# EAGLE design DCCInterfaceShield (EAGLE 9.6.2)
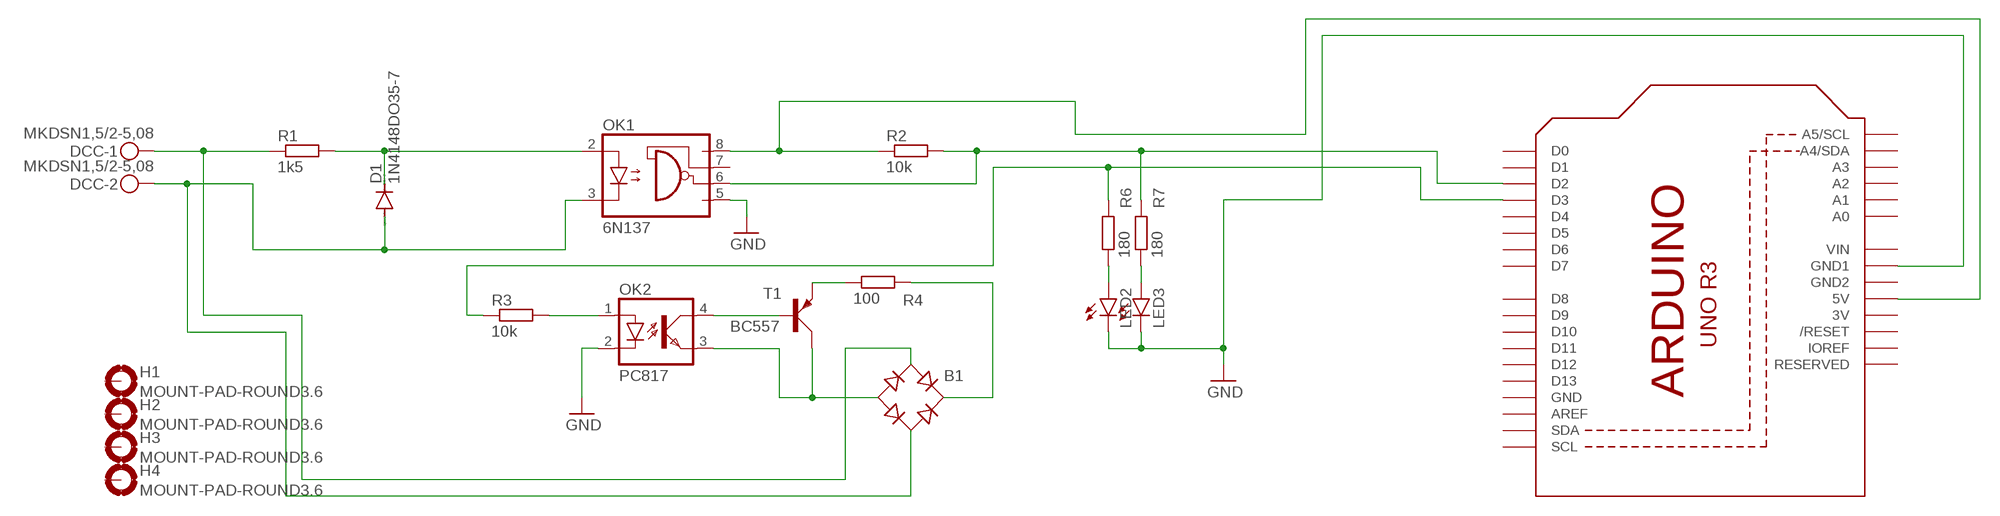
[diagram p0: schematic, sheet 1]

## Parts
B1  RB1A  [RB1A]
D1  1N4148DO35-7  [DO35-7]
DCC  MKDSN1,5/2-5,08  [MKDSN1,5/2-5,08]
H1  MOUNT-PAD-ROUND3.6  [3,6-PAD]
H2  MOUNT-PAD-ROUND3.6  [3,6-PAD]
H3  MOUNT-PAD-ROUND3.6  [3,6-PAD]
H4  MOUNT-PAD-ROUND3.6  [3,6-PAD]
LED2  LED3MM  [LED3MM]
LED3  LED3MM  [LED3MM]
OK1  6N137  [DIL08]
OK2  PC817  [DIL04]
R1  1k5  R-EU_0204/7  [0204/7]
R2  10k  R-EU_0204/7  [0204/7]
R3  10k  R-EU_0204/7  [0204/7]
R4  100  R-EU_0204/7  [0204/7]
R6  180  R-EU_0204/7  [0204/7]
R7  180  R-EU_0204/7  [0204/7]
T1  BC557  [SOT54A]
U1  ARDUINOR3-BPLACE  [ARDUINOR3-BPLACE]

## Nets
GND [GND]: LED2.K(C) LED3.K(C) OK1.5(GND) OK2.2(C) U1.GND1
N$3: D1.C OK1.2(A) R1.2
N$4: LED2.A R6.1
N$5: OK1.6(VO) R2.2 R7.2 U1.D2
N$6 [DCC]: B1.AC1 DCC.1 R1.1
N$7: OK2.1(A) R3.2
N$8: OK2.4(COL) T1.B
N$9 [VCC]: B1.+ R4.2
N$10 [VCC]: B1.- OK2.3(EMIT) T1.C
N$11: R4.1 T1.E
N$12: R3.1 R6.2 U1.D3
N$13 [DCC]: B1.AC2 D1.A DCC.2 OK1.3(C)
N$14: LED3.A R7.1
N$15: OK1.8(VCC) R2.1 U1.5V
Unconnected: H1.B3,6(MOUNT) H2.B3,6(MOUNT) H3.B3,6(MOUNT) H4.B3,6(MOUNT) OK1.7(VE) U1.A0 U1.A1 U1.A2 U1.A3 U1.A4(A4/SDA) U1.A5(A5/SCL) U1.AREF U1.D0 U1.D1 U1.D4 U1.D5 U1.D6 U1.D7 U1.D8 U1.D9 U1.D10 U1.D11 U1.D12 U1.D13 U1.IOREF U1.RESERVED U1.RESET(/RESET) U1.SCL U1.SDA

## Power pins joined to a net without a drawn wire
3V: U1.3V
GND: U1.GND
GND2: U1.GND2
VIN: U1.VIN

## Library data of the parts
B1 = rectifier:RB1A: RECTIFIER 1 A
D1 = diode:1N4148: DIODE high speed (Philips)
DCC = con-phoenix-508:MKDSN1,5/2-5,08: MKDSN 1,5/ 2-5,08 Printklemme Nennstrom: 13,5 A Nennspannung: 250 V Rastermaß: 5,08 mm Polzahl: 2 Anschlussart: Schraubanschluss Montage: Löten Anschlussrichtung Leiter/Platine: 0 ° Artikelnummer: 1729128 Source: http://eshop.phoenixcontact.com .. 1729128.pdf
H1-H4 = holes:MOUNT-PAD-ROUND: MOUNTING PAD, round
LED2 LED3 = led:LED: LED OSRAM: - CHIPLED LG R971, LG N971, LY N971, LG Q971, LY Q971, LO R971, LY R971 LH N974, LH R974 LS Q976, LO Q976, LY Q976 LO Q996 - Hyper CHIPLED LW Q18S LB Q993, LB Q99A, LB R99A - SideLED LS A670, LO A670, LY A670, LG A670, LP A670 LB A673, LV A673, LT A673, LW A673 LH A674 LY A675 LS A676, LA A676, LO A676, LY A676, LW A676 LS A679, LY A679, LG A679 - Hyper Micro SIDELED® LS Y876, LA Y876, LO Y876, LY Y876 LT Y87S - SmartLED LW L88C, LW L88S LB L89C, LB L89S, LG L890 LS L89K, LO L89K, LY L89K LS L896, LA L896, LO L896, LY L896 - TOPLED LS T670, LO T670, LY T670, LG T670, LP T670 LSG T670, LSP T670, LSY T670, LOP T670, LYG T670 LG T671, LOG T671, LSG T671 LB T673, LV T673, LT T673, LW T673 LH T674 LS T676, LA T676, LO T676, LY T676, LB T676, LH T676, LSB T676, LW T676 LB T67C, LV T67C, LT T67C, LS T67K, LO T67K, LY T67K, LW E67C LS E67B, LA E67B, LO E67B, LY E67B, LB E67C, LV E67C, LT E67C LW T67C LS T679, LY T679, LG T679 LS T770, LO T770, LY T770, LG T770, LP T770 LB T773, LV T773, LT T773, LW T773 LH T774 LS E675, LA E675, LY E675, LS T675 LS T776, LA T776, LO T776, LY T776, LB T776 LHGB T686 LT T68C, LB T68C - Hyper Mini TOPLED® LB M676 - Mini TOPLED Santana® LG M470 LS M47K, LO M47K, LY M47K Source: http://www.osram.convergy.de LUXEON: - LUMILED® LXK2-PW12-R00, LXK2-PW12-S00, LXK2-PW14-U00, LXK2-PW14-V00 LXK2-PM12-R00, LXK2-PM12-S00, LXK2-PM14-U00 LXK2-PE12-Q00, LXK2-PE12-R00, LXK2-PE12-S00, LXK2-PE14-T00, LXK2-PE14-U00 LXK2-PB12-K00, LXK2-PB12-L00, LXK2-PB12-M00, LXK2-PB14-N00, LXK2-PB14-P00, LXK2-PB14-Q00 LXK2-PR12-L00, LXK2-PR12-M00, LXK2-PR14-Q00, LXK2-PR14-R00 LXK2-PD12-Q00, LXK2-PD12-R00, LXK2-PD12-S00 LXK2-PH12-R00, LXK2-PH12-S00 LXK2-PL12-P00, LXK2-PL12-Q00, LXK2-PL12-R00 Source: www.luxeon.com KINGBRIGHT: KA-3528ASYC Source: www.kingbright.com
OK1 = optocoupler:6N137: MOTOROLA OPTO COUPLER; MPN: 6N137; OC_FARNELL: 1328376; OC_NEWARK: 52M1895
OK2 = optocoupler:PC817: SHARP OPTO COUPLER; MPN: PC817X4J000F; OC_FARNELL: 9707727; OC_NEWARK: 97K7059
R1-R4 R6 R7 = rcl:R-EU_: RESISTOR, European symbol; SPICEPREFIX: R
T1 = transistor-small-signal:BC557: PNP TRANSISTOR
U1 = adafruit:ARDUINOR3: This is a new object for the new Arduino R3 - with extra pins that you may want to use (such as IOref, and duplicated A4/A5

## Net classes
0 default: width 0.381 mm, clearance 0.381 mm
1 GND: width 0.762 mm, clearance 0.381 mm
2 DCC: width 0.635 mm, clearance 0.381 mm
3 VCC: width 0.635 mm, clearance 0.381 mm

## Board
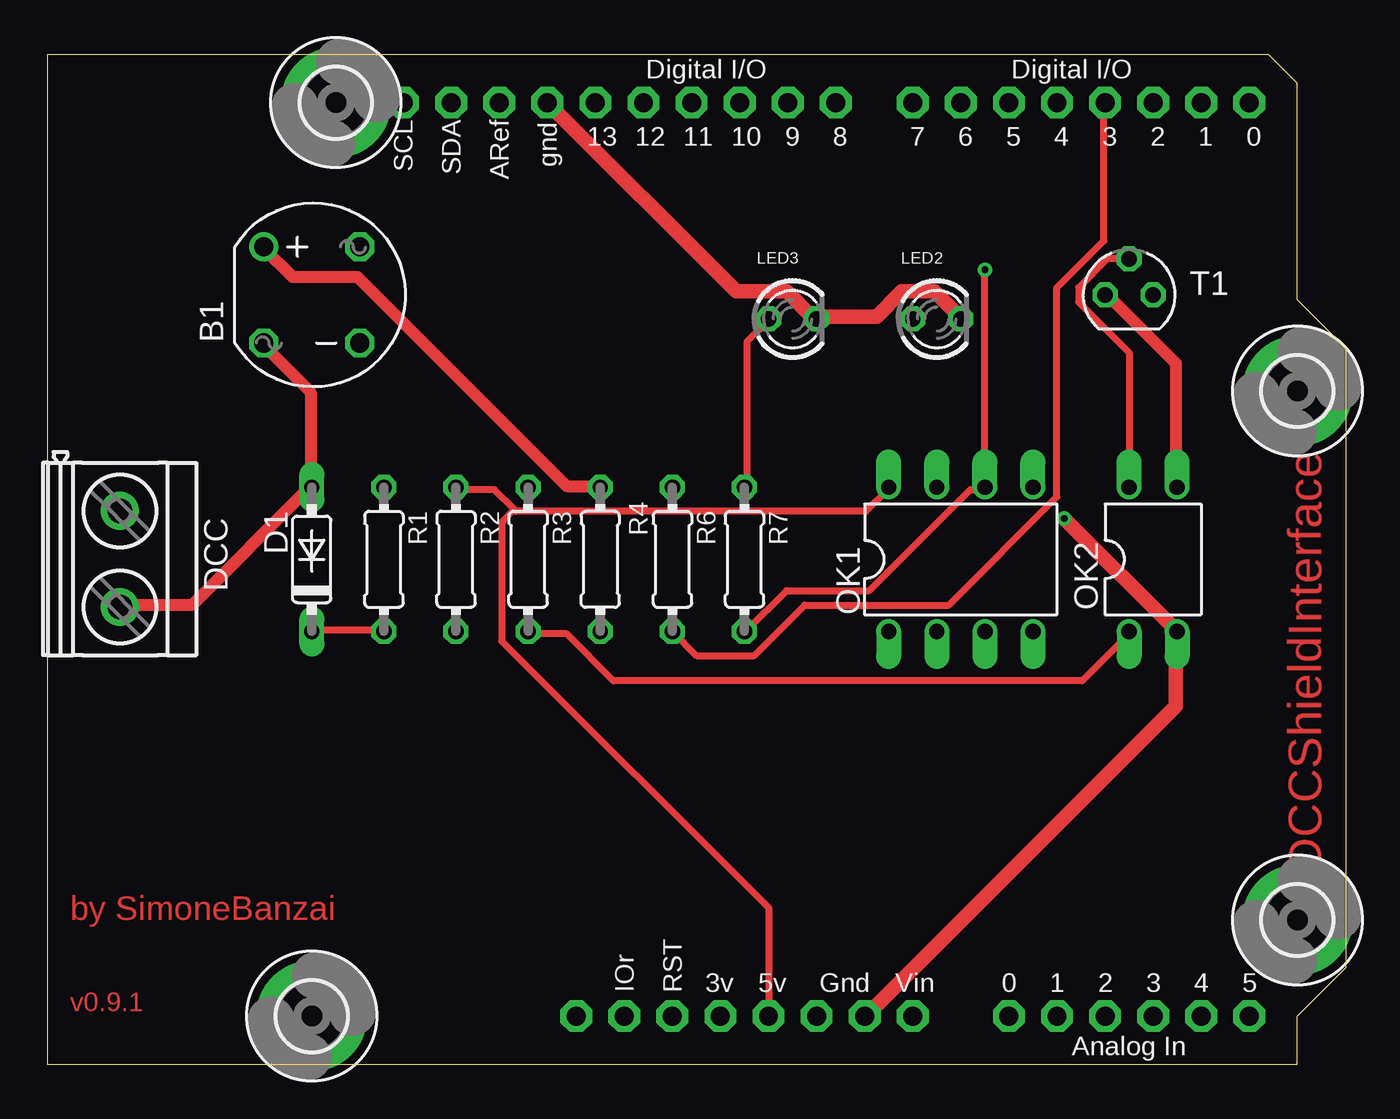
[diagram p1: board, top side]
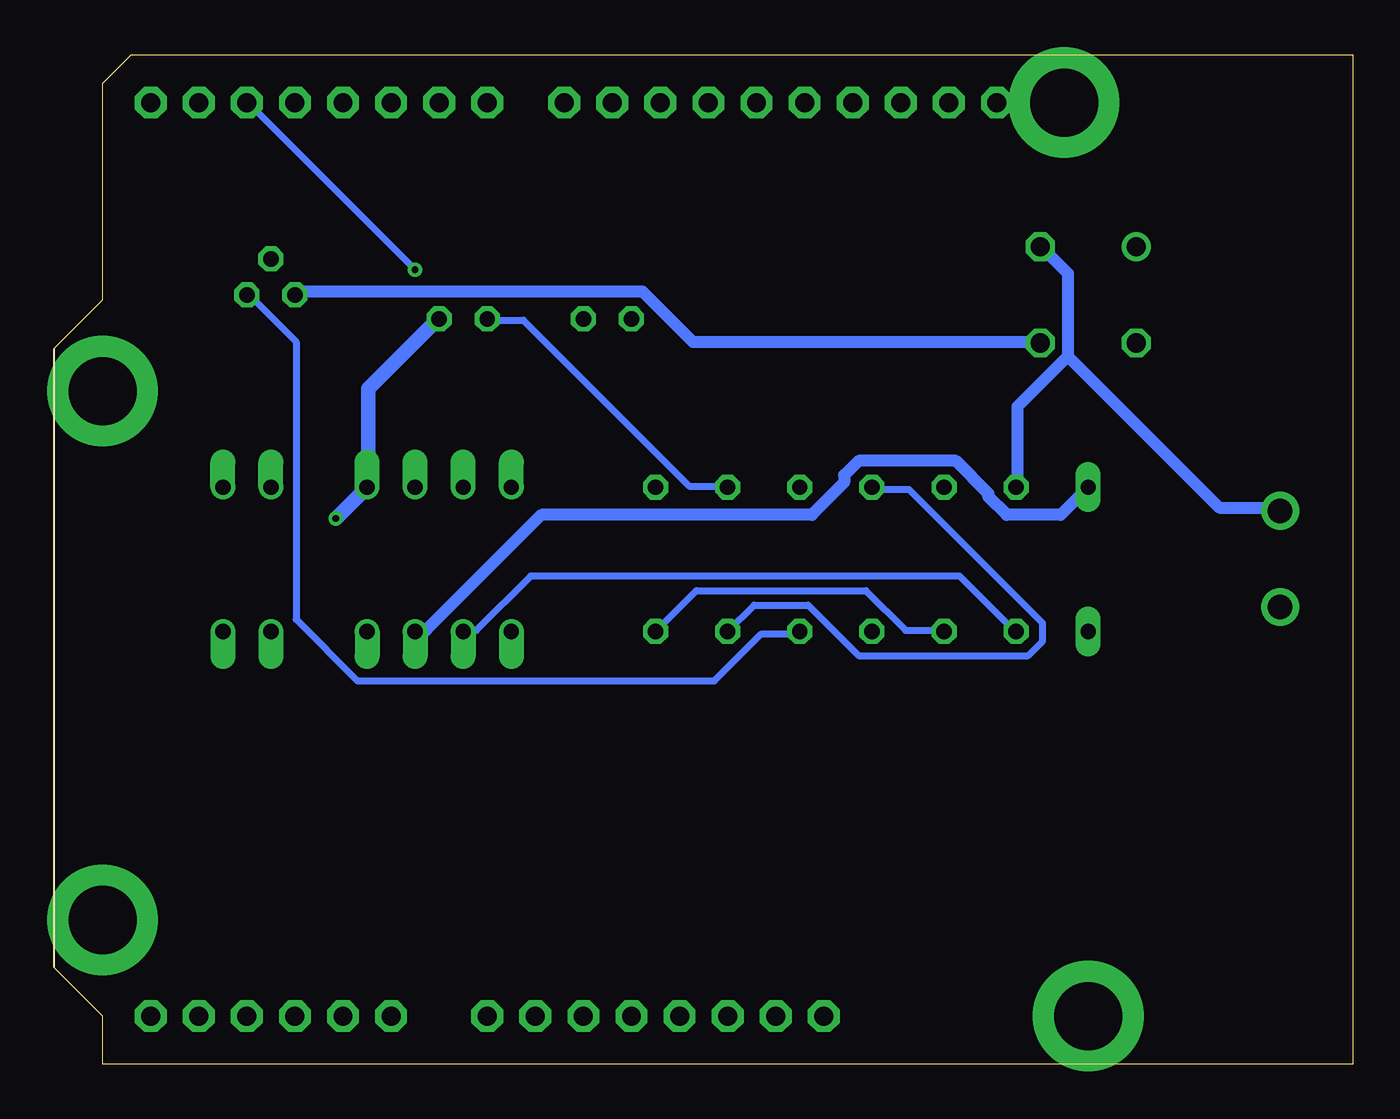
[diagram p2: board, bottom side, seen from below]

Size 68.63 x 53.33 mm. Coordinates in mm from the lower left corner, seen from the top.
Outline: 0,0 63.5,0 63.51,0 66.04,0 66.04,0 66.04,2.54 68.62,5.12 68.62,5.13 68.63,37.8 66.04,40.39 66.04,51.82 64.53,53.33 0,53.33 0,0
Copper layers (1*16): Top 0.035mm / dielectric 1.5mm / Bottom 0.035mm
Design rules "default": minimum track width 6mil, minimum drill 0.35mm, track to track 6mil, track to pad 6mil, pad to pad 6mil, via to via 6mil, smd to smd 6mil, copper to edge 40mil, drill to drill 6mil, minimum pad ring 10mil, minimum via ring 8mil, stop-mask expansion 4mil, vias tented up to drill 0mil, thermal gap 10mil

### Footprints (pad centres in the part's own frame; a part is rotated, then mirrored left to right if it is on the bottom)
RB1A = drill 1.016: + -2.54,2.54 | drill 1.016 octagon: - 2.54,-2.54; AC1 2.54,2.54; AC2 -2.54,-2.54
DO35-7 = drill 0.813 long: A 3.81,0; C -3.81,0
MKDSN1,5/2-5,08 = drill 1.3 pad 2: 1 -2.561,0.025; 2 2.519,0.025
3,6-PAD = drill 3.6 pad 5.842: B3,6 0,0
LED3MM = drill 0.813 octagon: A -1.27,0; K 1.27,0
DIL08 = drill 0.813 offset: 1 -3.81,-3.81; 2 -1.27,-3.81; 3 1.27,-3.81; 4 3.81,-3.81; 5 3.81,3.81; 6 1.27,3.81; 7 -1.27,3.81; 8 -3.81,3.81
DIL04 = drill 0.813 offset: 1 -1.27,-3.81; 2 1.27,-3.81; 3 1.27,3.81; 4 -1.27,3.81
0204/7 = drill 0.813 octagon: 1 -3.81,0; 2 3.81,0
SOT54A = drill 0.813 octagon: B 0,1.905; C -1.27,0; E 1.27,0
ARDUINOR3-BPLACE = drill 1 pad 1.676 octagon: 3V 35.56,2.54; 5V 38.1,2.54; A0 50.8,2.54; A1 53.34,2.54; A2 55.88,2.54; A3 58.42,2.54; A4 60.96,2.54; A5 63.5,2.54; AREF 23.876,50.8; D0 63.5,50.8; D1 60.96,50.8; D2 58.42,50.8; D3 55.88,50.8; D4 53.34,50.8; D5 50.8,50.8; D6 48.26,50.8; D7 45.72,50.8; D8 41.656,50.8; D9 39.116,50.8; D10 36.576,50.8; D11 34.036,50.8; D12 31.496,50.8; D13 28.956,50.8; GND 26.416,50.8; GND1 43.18,2.54; GND2 40.64,2.54; IOREF 30.48,2.54; RESERVED 27.94,2.54; RESET 33.02,2.54; SCL 18.796,50.8; SDA 21.336,50.8; VIN 45.72,2.54

### Placement (x,y rotation side)
B1  13.97,40.64 0 top
D1  13.97,26.67 90 top
DCC  3.81,26.67 270 top
H1  13.97,2.54 0 top
H2  66.04,7.62 0 top
H3  15.24,50.8 0 top
H4  66.04,35.56 0 top
LED2  46.99,39.37 0 top
LED3  39.37,39.37 0 top
OK1  48.26,26.67 0 top
OK2  58.42,26.67 0 top
R1  17.78,26.67 270 top
R2  21.59,26.67 270 top
R3  25.4,26.67 270 top
R4  29.21,26.67 90 top
R6  33.02,26.67 270 top
R7  36.83,26.67 270 top
T1  57.15,40.64 0 top
U1  0,0 0 top

### Tracks (layer width: path | path; a pad name or v marks a point on that pad's centre or on a via)
GND  (via drill 0.35)
  Top 0.762: U1.GND1 43.24,2.54 59.63,18.92 59.63,22.73 OK2.2 v53.72,28.83 | LED2.K 48.2,39.5 46.86,40.83 45.15,40.83 43.81,39.5 40.77,39.5 LED3.K 40.39,39.5 39.05,40.83 36.39,40.83 U1.GND
  Bottom 0.762: LED2.K 48.39,39.31 52.01,35.69 52.01,30.54 OK1.5 v53.72,28.83
N$3
  Top 0.381: D1.C 14.1,22.92 17.72,22.92 R1.2
  Bottom 0.381: OK1.2 46.86,22.92 46.29,22.92 43.43,25.78 20.77,25.78 17.91,22.92 R1.2
N$4
  Bottom 0.381: R6.1 33.15,30.54 35.05,30.54 43.81,39.31 45.72,39.31 LED2.A
N$5  (via drill 0.35)
  Top 0.381: R7.2 36.96,22.92 39.05,25.02 43.43,25.02 48.77,30.35 49.53,30.35 OK1.6 v49.53,41.97
  Bottom 0.381: R7.2 34.67,25.02 25.72,25.02 23.62,22.92 21.72,22.92 R2.2 | v49.53,41.97 58.29,50.74 U1.D2
N$6
  Bottom 0.635: 15.05,37.4 17.72,34.73 17.72,30.54 R1.1 | 15.05,37.4 15.05,41.78 16.38,43.12 B1.AC1 | 15.05,37.4 7.05,29.4 4,29.4 DCC.1
N$7
  Top 0.381: R3.2 25.53,22.73 27.43,22.73 29.91,20.26 54.67,20.26 57.15,22.73 OK2.1
N$8
  Top 0.381: OK2.4 57.15,37.59 54.48,40.26 54.48,41.02 56.01,42.55 T1.B
N$9
  Top 0.635: R4.2 29.15,30.54 27.43,30.54 16.38,41.59 12.95,41.59 11.43,43.12 B1.+
N$10
  Top 0.635: OK2.3 59.63,30.54 59.63,37.02 56.01,40.64 T1.C
  Bottom 0.635: B1.- 16.57,38.16 34.86,38.16 37.53,40.83 55.63,40.83 55.82,40.64 T1.C
N$11
  Bottom 0.381: R4.1 29.34,22.73 31.24,22.73 33.72,20.26 52.58,20.26 55.82,23.5 55.82,38.16 58.29,40.64 T1.E
N$12
  Top 0.381: R6.2 34.29,21.59 37.34,21.59 40,24.26 47.62,24.26 53.34,29.97 53.34,41.02 55.82,43.5 55.82,50.74 U1.D3
  Bottom 0.381: R6.2 31.62,24.26 28.77,24.26 26.1,21.59 17.14,21.59 16.38,22.35 16.38,23.31 23.43,30.35 25.34,30.35 R3.1
N$13
  Top 0.635: B1.AC2 11.43,37.97 13.91,35.5 13.91,30.54 D1.A 13.72,30.35 7.62,24.26 4,24.26 DCC.2
  Bottom 0.635: D1.A 15.43,29.02 18.29,29.02 19.24,29.97 19.24,30.16 20.96,31.88 26.1,31.88 26.86,31.11 26.86,30.73 28.57,29.02 42.86,29.02 48.96,22.92 49.53,22.92 OK1.3
N$14
  Top 0.381: R7.1 36.96,30.54 36.96,38.16 38.1,39.31 LED3.A
N$15
  Top 0.381: 24.67,29.31 24.77,29.21 43.24,29.21 44.39,30.35 OK1.8 | 24.67,29.31 23.62,30.35 21.72,30.35 R2.1 | U1.5V 38.1,8.25 24,22.35 24,28.64 24.67,29.31

### Text on the board
Top: DCCShieldInterface | by SimoneBanzai | v0.9.1